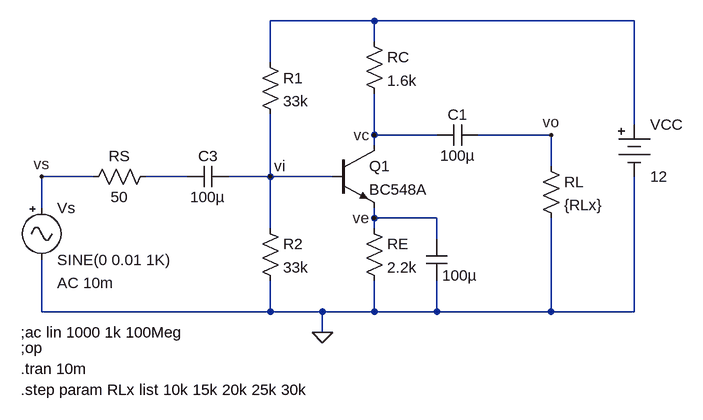
[diagram p0: schematic 3_12_pablo_gomez_tp5_ej3.asc]
3_12_pablo_gomez_tp5_ej3.asc, the LTspice schematic file:
Version 4
SHEET 1 880 680
WIRE 384 -160 224 -160
WIRE 784 -160 384 -160
WIRE 384 -128 384 -160
WIRE 224 -96 224 -160
WIRE 784 0 784 -160
WIRE 384 16 384 -48
WIRE 480 16 384 16
WIRE 656 16 544 16
WIRE 384 32 384 16
WIRE 656 64 656 16
WIRE -48 80 -128 80
WIRE 96 80 32 80
WIRE 224 80 224 -16
WIRE 224 80 160 80
WIRE 320 80 224 80
WIRE -128 128 -128 80
WIRE 384 144 384 128
WIRE 480 144 384 144
WIRE 224 160 224 80
WIRE 384 160 384 144
WIRE 480 176 480 144
WIRE -128 288 -128 208
WIRE 224 288 224 240
WIRE 224 288 -128 288
WIRE 304 288 224 288
WIRE 384 288 384 240
WIRE 384 288 304 288
WIRE 480 288 480 240
WIRE 480 288 384 288
WIRE 656 288 656 144
WIRE 656 288 480 288
WIRE 784 288 784 80
WIRE 784 288 656 288
WIRE 304 320 304 288
FLAG 304 320 0
FLAG 224 80 vi
FLAG 656 16 vo
FLAG 384 16 vc
FLAG 384 144 ve
FLAG -128 80 vs
SYMBOL Misc\\signal -128 112 R0
WINDOW 123 24 132 Left 2
WINDOW 39 0 0 Left 0
SYMATTR Value2 AC 10m
SYMATTR InstName Vs
SYMATTR Value SINE(0 0.01 1K)
SYMBOL res 48 64 R90
WINDOW 0 0 56 VBottom 2
WINDOW 3 32 56 VTop 2
SYMATTR InstName RS
SYMATTR Value 50
SYMBOL res 208 144 R0
SYMATTR InstName R2
SYMATTR Value 33k
SYMBOL res 208 -112 R0
SYMATTR InstName R1
SYMATTR Value 33k
SYMBOL res 368 144 R0
SYMATTR InstName RE
SYMATTR Value 2.2k
SYMBOL res 640 48 R0
SYMATTR InstName RL
SYMATTR Value {RLx}
SYMBOL res 368 -144 R0
SYMATTR InstName RC
SYMATTR Value 1.6k
SYMBOL cap 480 32 R270
WINDOW 0 32 32 VTop 2
WINDOW 3 0 32 VBottom 2
SYMATTR InstName C1
SYMATTR Value 100µ
SYMBOL cap 464 176 R0
WINDOW 0 24 8 Invisible 2
SYMATTR InstName C2
SYMATTR Value 100µ
SYMBOL cap 160 64 R90
WINDOW 0 0 32 VBottom 2
WINDOW 3 32 32 VTop 2
SYMATTR InstName C3
SYMATTR Value 100µ
SYMBOL npn 320 32 R0
SYMATTR InstName Q1
SYMATTR Value BC548A
SYMBOL Misc\\battery 784 -16 R0
WINDOW 123 0 0 Left 0
WINDOW 39 0 0 Left 0
SYMATTR InstName VCC
SYMATTR Value 12
TEXT -160 344 Left 2 !;op
TEXT -160 376 Left 2 !.tran 10m
TEXT -160 320 Left 2 !;ac lin 1000 1k 100Meg
TEXT -160 408 Left 2 !.step param RLx list 10k 15k 20k 25k 30k

The netlist it stands for:
* 3_12_pablo_gomez_tp5_ej3.asc
Vs vs 0 SINE(0 0.01 1K) AC 10m
RS N002 vs 50
R2 vi 0 33k
R1 N001 vi 33k
RE ve 0 2.2k
RL vo 0 {RLx}
RC N001 vc 1.6k
C1 vc vo 100µ
C2 ve 0 100µ
C3 vi N002 100µ
Q1 vc vi ve 0 BC548A
VCC N001 0 12
.model NPN NPN
.model PNP PNP
.lib standard.bjt
;op
.tran 10m
;ac lin 1000 1k 100Meg
.step param RLx list 10k 15k 20k 25k 30k
.backanno
.end